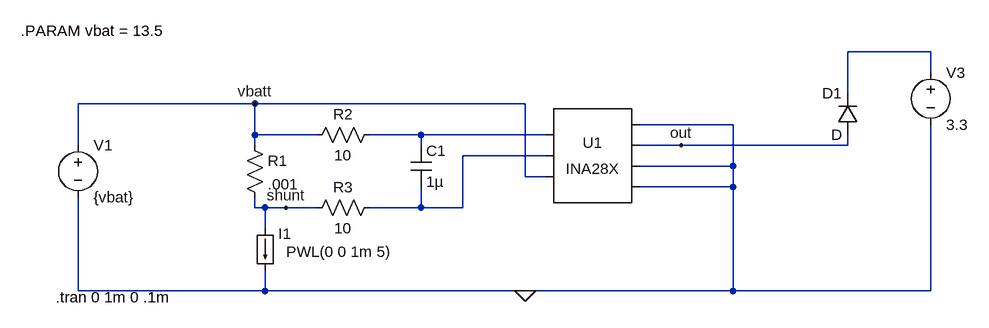
[diagram p0: schematic INA28X_currentShunt.asc]
INA28X_currentShunt.asc, the LTspice schematic file:
Version 4
SHEET 1 1032 680
WIRE 800 -80 672 -80
WIRE 800 -48 800 -80
WIRE 672 -16 672 -80
WIRE -240 0 -512 0
WIRE 176 0 -240 0
WIRE 496 32 352 32
WIRE -240 48 -240 0
WIRE -144 48 -240 48
WIRE 16 48 -64 48
WIRE 208 48 16 48
WIRE -512 64 -512 0
WIRE -240 64 -240 48
WIRE 16 64 16 48
WIRE 416 64 352 64
WIRE 672 64 672 48
WIRE 672 64 416 64
WIRE 208 80 80 80
WIRE 496 96 496 32
WIRE 496 96 352 96
WIRE 176 112 176 0
WIRE 208 112 176 112
WIRE 496 128 496 96
WIRE 496 128 352 128
WIRE -240 160 -240 144
WIRE -224 160 -240 160
WIRE -192 160 -224 160
WIRE -144 160 -192 160
WIRE 16 160 16 128
WIRE 16 160 -64 160
WIRE 80 160 80 80
WIRE 80 160 16 160
WIRE -224 192 -224 160
WIRE -512 288 -512 144
WIRE -224 288 -224 256
WIRE -224 288 -512 288
WIRE 176 288 -224 288
WIRE 496 288 496 128
WIRE 496 288 176 288
WIRE 800 288 800 32
WIRE 800 288 496 288
FLAG 416 64 out
FLAG -192 160 shunt
FLAG -240 0 vbatt
FLAG 176 288 0
SYMBOL res -256 48 R0
SYMATTR InstName R1
SYMATTR Value .001
SYMBOL res -48 32 R90
WINDOW 0 0 56 VBottom 2
WINDOW 3 32 56 VTop 2
SYMATTR InstName R2
SYMATTR Value 10
SYMBOL res -48 144 R90
WINDOW 0 0 56 VBottom 2
WINDOW 3 32 56 VTop 2
SYMATTR InstName R3
SYMATTR Value 10
SYMBOL cap 0 64 R0
SYMATTR InstName C1
SYMATTR Value 1µ
SYMBOL AutoGenerated\\INA28X 272 80 R0
SYMATTR InstName U1
SYMATTR SpiceLine TR_Mode=1 G=1000
SYMBOL voltage -512 48 R0
WINDOW 123 0 0 Left 2
WINDOW 39 0 0 Left 2
SYMATTR InstName V1
SYMATTR Value {vbat}
SYMBOL diode 688 48 R180
WINDOW 0 24 64 Left 2
WINDOW 3 24 0 Left 2
SYMATTR InstName D1
SYMBOL voltage 800 -64 R0
WINDOW 123 0 0 Left 2
WINDOW 39 0 0 Left 2
SYMATTR InstName V3
SYMATTR Value 3.3
SYMBOL load -240 192 R0
WINDOW 3 48 36 Left 2
WINDOW 123 0 0 Left 2
WINDOW 39 0 0 Left 2
SYMATTR InstName I1
SYMATTR Value PWL(0 0 1m 5)
TEXT -546 298 Left 2 !.tran 0 1m 0 .1m
TEXT -600 -112 Left 2 !.PARAM vbat = 13.5

The netlist it stands for:
* INA28X_currentShunt.asc
R1 vbatt shunt .001
R2 N002 vbatt 10
R3 N003 shunt 10
C1 N002 N003 1µ
* U1: INA28X TR_Mode=1 G=1000 (symbol AutoGenerated\INA28X not available, pins judged from their places): pin1=N002 pin2=N003 pin3=vbatt pin4=0 pin5=out pin6=0 pin7=0
V1 vbatt 0 {vbat}
D1 out N001 D
V3 N001 0 3.3
I1 shunt 0 PWL(0 0 1m 5)
.model D D
.lib standard.dio
.tran 0 1m 0 .1m
.PARAM vbat = 13.5
.backanno
.end